# Altium schematic sheet Main_4x4.SchDoc
size A
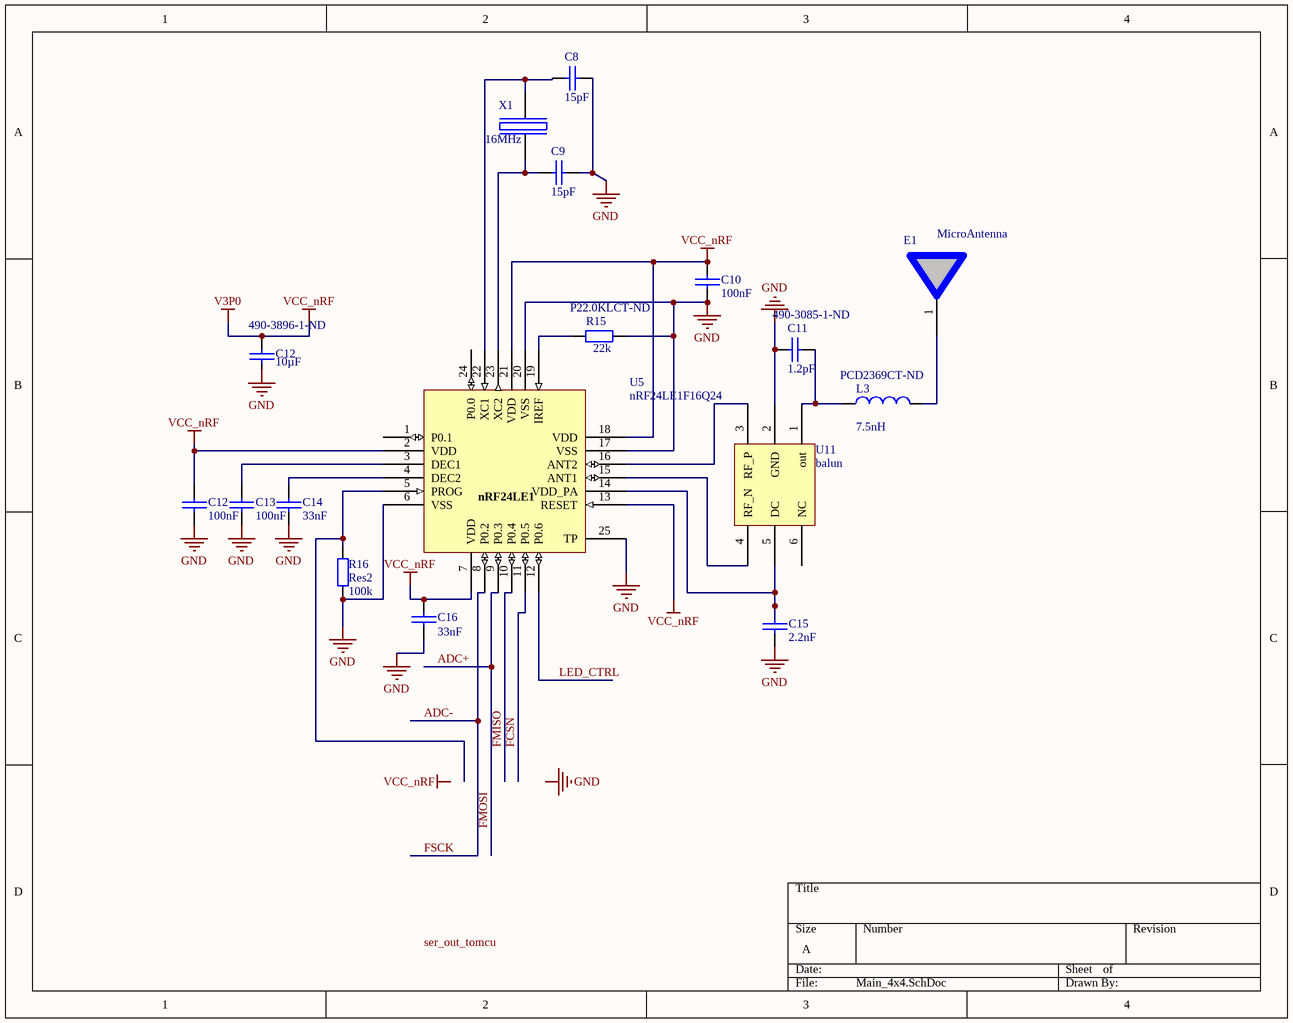
[diagram p0: Main_4x4.SchDoc]

## Parts
(Parts that share a designator on the sheet are numbered #1, #2 ... from top to bottom, then left to right.)
C8  value 15pF  [0402s]  (hidden comment: NP0 50V)
C9  value 15pF  [0402s]  (hidden comment: NP0 50V)
C10  value 100nF  [0402s]  (hidden comment: NP0 50V)
C11  value 1.2pF  Supplier Part Number 1: 490-3085-1-ND  [0402s]  (hidden comment: NP0 50V)
C12#1  Supplier Part Number 1: 490-3896-1-ND  Capacitance: 10µF  [0402s]  (hidden comment: NP0 50V)
C12#2  value 100nF  [0402s]  (hidden comment: NP0 50V)
C13  value 100nF  [0402s]  (hidden comment: NP0 50V)
C14  value 33nF  [0402s]  (hidden comment: NP0 50V)
C15  value 2.2nF  [0402s]  (hidden comment: NP0 50V)
C16  value 33nF  [0402s]  (hidden comment: NP0 50V)
E1  MicroAntenna  [microantenna]
L3  value 7.5nH  Supplier Part Number 1: PCD2369CT-ND  [0402-A]  (hidden comment: Inductor)
R15  value 22k  Supplier Part Number 1: P22.0KLCT-ND  [0402s]  (hidden comment: Res2)
R16  Res2  value 100k  [0402s]
U5  value nRF24LE1F16Q24  [NORDIC_QFN50P400X400X90-25N]  (hidden comment: QFN24 4x4 package)
U11  balun  [balun]
X1  value 16MHz  [bt-xtal 2.5 x 2 mm]  (hidden comment: TSX-3225, 16MHz, Cl=9pF, +/-10ppm)

## Nets
GND: C8.1 C9.2 C10.2 C11.1 C12#2.2 C13.1 C14.2 C15.2 C16.1 R15.2 R16.1 U5.6(VSS) U5.17(VSS) U5.20(VSS) U5.25(TP) U11.2(GND) X1.2(GND) X1.4(GND)
V3P0: C10.1 C12#1.1 C12#2.1 C16.2 U5.2(VDD) U5.7(VDD) U5.13(RESET) U5.18(VDD) U5.21(VDD)  [also labelled VCC_nRF]
ADC+: U5.9(P0.3)  [also labelled FMOSI]
ADC-: U5.8(P0.2)  [also labelled FSCK]
FCSN: U5.11(P0.5)
FMISO: U5.10(P0.4)
LED_CTRL: U5.12(P0.6)
NetC8_2: C8.2 U5.22(XC1) X1.3(out)
NetC9_1: C9.1 U5.23(XC2) X1.1(inp)
NetC11_2: C11.2 L3.1 U11.1(out)
NetC13_2: C13.2 U5.3(DEC1)
NetC14_1: C14.1 U5.4(DEC2)
NetC15_1: C15.1 U5.14(VDD_PA) U11.5(DC)
NetE1_1: E1.1 L3.2
NetR15_1: R15.1 U5.19(IREF)
NetR16_2: R16.2 U5.5(PROG)
NetU5_15: U5.15(ANT1) U11.4(RF_N)
NetU5_16: U5.16(ANT2) U11.3(RF_P)

Not connected (* = marked no-connect by the designer): C12#1 2; E1 2; U5 1(P0.1) 24(P0.0); U11 6(NC)

## Notes on the sheet
- Labels drawn without touching a wire or pin: GND, ser_out_tomcu, VCC_nRF
- (in symbol nRF24LE1 - 4x4) nRF24LE1

## Library data of the parts
C8-C10 C12#2 C13 C14 C16 = Cap: Capacitor; Part Field 1: 0402
C11 = Cap: Capacitor; Part Field 1: 0402; Manufacturer: Murata Electronics North America; Manufacturer Part Number: GJM1555C1H1R2CB01D; Description: CAP CERAMIC 1.2PF 50V C0G 0402; Tolerance: ±0.25pF; Temperature Coefficient: C0G, NP0; Supplier 1: Digi-Key; RoHS: RoHS Compliant; Category: Capacitors; Stock 1: 74898; Pricing 1: 1=0.23, 10=0.143, 50=0.0686, 100=0.0515, 250=0.0372, 500=0.02746, 1000=0.01859 (USD); Capacitance: 1.2pF; Voltage - Rated: 50V; Mounting Type: Surface Mount, MLCC; Operating Temperature: -55°C ~ 125°C; Applications: RF, Microwave, High Frequency; Ratings: -; Package / Case: 0402 (1005 Metric); Size / Dimension: 0.039" L x 0.020" W (1.00mm x 0.50mm); Height: -; Thickness: 0.022" (0.55mm); Lead Spacing: -; Features: High Q, Low Loss; Packaging: Cut Tape (CT); Lead Style: -; ComponentLink1URL: http://search.murata.co.jp/Ceramy/image/img/PDF/ENG/GJM1555C1H1R2CB01.pdf; ComponentLink1Description: http://search.murata.co.jp/Ceramy/image/img/PDF/ENG/GJM1555C1H1R2CB01.pdf
C12#1 = Cap: Capacitor; Part Field 1: 0402; Manufacturer: Murata Electronics North America; Manufacturer Part Number: GRM188R60J106ME47D; Value: 10uF; Description: CAP CER 10UF 6.3V X5R 0603; Voltage - Rated: 6.3V; Tolerance: ±20%; Temperature Coefficient: X5R; Supplier 1: Digi-Key; RoHS: RoHS Compliant; Category: Capacitors; Stock 1: 1364710; Pricing 1: 1=0.51, 10=0.398, 50=0.2624, 100=0.208, 250=0.15376, 500=0.1194, 1000=0.09407 (USD); Mounting Type: Surface Mount, MLCC; Operating Temperature: -55°C ~ 85°C; Applications: General Purpose; Ratings: -; Package / Case: 0603 (1608 Metric); Size / Dimension: 0.063" L x 0.031" W (1.60mm x 0.80mm); Height: -; Thickness: 0.035" (0.90mm); Lead Spacing: -; Features: -; Packaging: Cut Tape (CT); Lead Style: -; ComponentLink1URL: http://search.murata.co.jp/Ceramy/image/img/PDF/ENG/GRM188R60J106ME47.pdf; ComponentLink1Description: http://search.murata.co.jp/Ceramy/image/img/PDF/ENG/GRM188R60J106ME47.pdf
C15 = Cap: Capacitor; Part Field 1: 0402; Manufacturer: Johanson Dielectrics Inc; Manufacturer Part Number: 500R07W222KV4T; Description: CAP CER 2200PF 50V X7R 0402; Capacitance: 2200pF; Tolerance: ±10%; Temperature Coefficient: X7R; Supplier 1: Digi-Key; Supplier Part Number 1: 709-1135-1-ND; RoHS: RoHS Compliant; Category: Capacitors; Stock 1: 33069; Pricing 1: 10=0.029, 100=0.0169, 500=0.00976, 1000=0.00676 (USD); Voltage - Rated: 50V; Mounting Type: Surface Mount, MLCC; Operating Temperature: -55°C ~ 125°C; Applications: General Purpose; Ratings: -; Package / Case: 0402 (1005 Metric); Size / Dimension: 0.040" L x 0.020" W (1.02mm x 0.51mm); Height: -; Thickness: 0.025" (0.64mm); Lead Spacing: -; Features: -; Packaging: Cut Tape (CT); Lead Style: -; ComponentLink1URL: http://www.johansondielectrics.com/images/stories/surface-mount/smt-mlc/JDI_Surface-Mount_2008-11.pdf; ComponentLink1Description: http://www.johansondielectrics.com/images/stories/surface-mount/smt-mlc/JDI_Surface-Mount_2008-11.pdf
L3 = Inductor: Manufacturer: Panasonic - ECG; Manufacturer Part Number: ELJ-RF7N5ZFB; Code_IEC: 1005; Description: INDUCTOR 7.5NH +/-.2NH 0402 SMD; Current: 320mA; Type: Non-Magnetic Core; Tolerance: ±0.2nH; DC Resistance (DCR): 330 mOhm Max; Q @ Freq: 8 @ 100MHz; Self Resonant Freq: 3.7GHz; Frequency - Test: 100MHz; Published: 8-Jun-2000; LatestRevisionDate: 29-May-2009; LatestRevisionNote: IPC-7351 Footprint Added.; PackageReference: 0402-A; Publisher: Altium Limited; PackageDescription: Chip Inductor; Code_JEITA: 0402; Supplier 1: Digi-Key; RoHS: RoHS Compliant; Category: Inductors, Coils, Chokes; Stock 1: 19666; Pricing 1: 1=0.08, 50=0.0786, 100=0.0593, 500=0.05446, 1000=0.04356 (USD); Inductance: 7.5nH; Current - Saturation: -; Current - Temperature Rise: -; Shielding: -; Package / Case: 0402 (1005 Metric); Mounting Type: Surface Mount; Packaging: Cut Tape (CT); Operating Temperature: -20°C ~ 85°C; Material - Core: -; Applications: High Frequency; ComponentLink1URL: http://industrial.panasonic.com/www-cgi/jvcr13pz.cgi?E+PZ+3+AGA0024+ELJRF7N5ZFB+7+WW; ComponentLink1Description: http://industrial.panasonic.com/www-cgi/jvcr13pz.cgi?E+PZ+3+AGA0024+ELJRF7N5ZFB+7+WW
R15 = Res2: Resistor; Manufacturer: Panasonic - ECG; Manufacturer Part Number: ERJ-2RKF2202X; Description: RES 22.0K OHM 1/10W 1% 0402 SMD; Power (Watts): 0.1W, 1/10W; Temperature Coefficient: ±100ppm/°C; Tolerance: ±1%; Published: 8-Jun-2000; LatestRevisionDate: 17-Jul-2002; LatestRevisionNote: Re-released for DXP Platform.; PackageReference: AXIAL-0.4; Publisher: Altium Limited; PackageDescription: Axial Device, Thru-Hole; 2 Leads; 0.4 in Pin Spacing; Supplier 1: Digi-Key; RoHS: RoHS Compliant; Category: Resistors; Stock 1: 495835; Pricing 1: 1=0.06, 50=0.0242, 100=0.0184, 250=0.01364, 500=0.01008, 1000=0.00672, 5000=0.00473 (USD); Resistance (Ohms): 22K; Composition: Thick Film; Features: -; Size / Dimension: 0.039" L x 0.020" W (1.00mm x 0.50mm); Height: 0.014" (0.35mm); Number of Terminations: 2; Packaging: Cut Tape (CT); Package / Case: 0402 (1005 Metric); ComponentLink1URL: http://industrial.panasonic.com/www-cgi/jvcr13pz.cgi?E+PZ+3+AOA0002+ERJ2RKF2202X+7+WW; ComponentLink1Description: http://industrial.panasonic.com/www-cgi/jvcr13pz.cgi?E+PZ+3+AOA0002+ERJ2RKF2202X+7+WW
R16 = Res2: Resistor; Published: 8-Jun-2000; LatestRevisionDate: 17-Jul-2002; LatestRevisionNote: Re-released for DXP Platform.; PackageReference: AXIAL-0.4; Publisher: Altium Limited; PackageDescription: Axial Device, Thru-Hole; 2 Leads; 0.4 in Pin Spacing
U5 = nRF24LE1 - 4x4: 2.4GHz Tranceiver with embedded MCU and 10 bit ADC
X1 = BT-XTAL: Crystal; Manufacturer: NDK; Manufacturer Part Number: NX2520SA-16.000000MHZ; Description: CRYSTAL 16.000000 MHZ 10PF SMD; Frequency Stability: ±10ppm; Load Capacitance: 10pF; Operating Mode: Fundamental; Supplier 1: Digi-Key; Supplier Part Number 1: 644-1059-1-ND; RoHS: RoHS Compliant; Category: Crystals and Oscillators; Stock 1: 12667; Pricing 1: 1=2.12, 10=1.839, 50=1.6128, 100=1.2733, 500=1.07524, 750=0.93943, 1000=0.84888 (USD); Type: MHz Crystal; Frequency: 16MHz; Frequency Tolerance: ±10ppm; Operating Temperature: -10°C ~ 60°C; Mounting Type: Surface Mount; Package / Case: 4-SMD, No Lead (DFN, LCC); Size / Dimension: 0.098" L x 0.079" W (2.50mm x 2.00mm); Height: 0.026" (0.65mm); Packaging: Cut Tape (CT); ComponentLink1URL: http://media.digikey.com/pdf/Data%20Sheets/NDK%20PDFs/NX2520SA.pdf; ComponentLink1Description: http://media.digikey.com/pdf/Data%20Sheets/NDK%20PDFs/NX2520SA.pdf